# Altium schematic sheet rf transmitter.SchDoc
size A
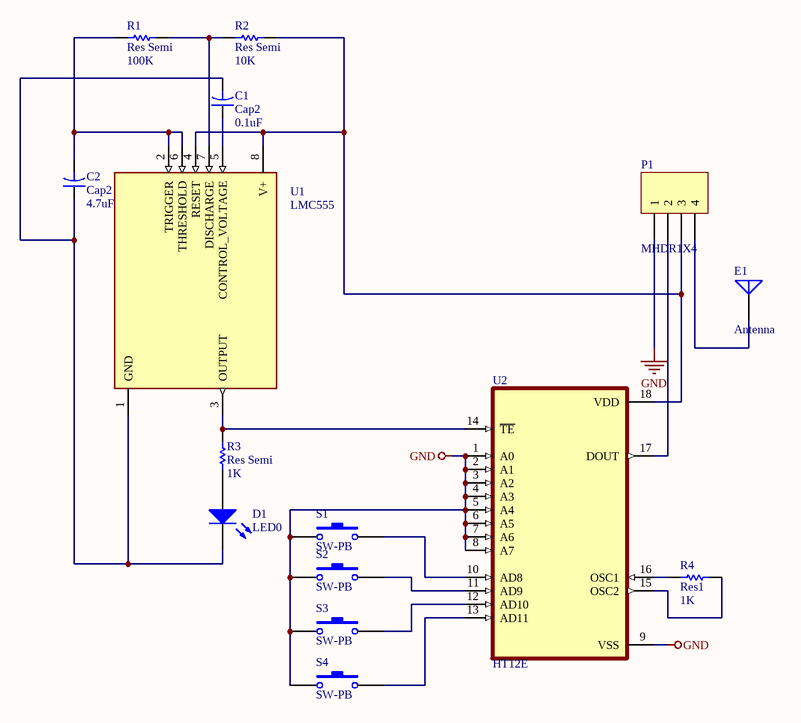
[diagram p0: rf transmitter.SchDoc]

## Parts
C1  Cap2  value 0.1uF  [CAPR5-4X5]
C2  Cap2  value 4.7uF  [CAPR5-4X5]
D1  LED0  [LED-0]
E1  Antenna  [PIN1]
P1  MHDR1X4  [MHDR1X4]
R1  Res Semi  value 100K  [AXIAL-0.5]
R2  Res Semi  value 10K  [AXIAL-0.5]
R3  Res Semi  value 1K  [AXIAL-0.5]
R4  Res1  value 1K  [AXIAL-0.3]
S1  SW-PB  [SPST-2]
S2  SW-PB  [SPST-2]
S3  SW-PB  [SPST-2]
S4  SW-PB  [SPST-2]
U1  LMC555  [LMC555new]
U2  HT12E  [HT12E]

## Nets
GND: P1.1 S1.1 S2.1 S3.1 S4.1 U2.1(A0) U2.2(A1) U2.3(A2) U2.4(A3) U2.5(A4) U2.6(A5) U2.7(A6) U2.8(A7) U2.9(VSS)
NetC1_1: C1.1 U1.5(CONTROL_VOLTAGE)
NetC1_2: C1.2 C2.1 D1.2(K) U1.1(GND)
NetC2_2: C2.2 R1.1 U1.2(TRIGGER) U1.6(THRESHOLD)
NetD1_1: D1.1(A) R3.1
NetE1_1: E1.1(A) P1.4
NetP1_2: P1.2 U2.17(DOUT)
NetP1_3: P1.3 R2.2 U1.4(RESET) U1.8(V+) U2.18(VDD)
NetR1_2: R1.2 R2.1 U1.7(DISCHARGE)
NetR3_2: R3.2 U1.3(OUTPUT) U2.14(~{TE})
NetR4_1: R4.1 U2.16(OSC1)
NetR4_2: R4.2 U2.15(OSC2)
NetS1_2: S1.2 U2.10(AD8)
NetS2_2: S2.2 U2.11(AD9)
NetS3_2: S3.2 U2.12(AD10)
NetS4_2: S4.2 U2.13(AD11)

## Library data of the parts
C1 C2 = Cap2: Capacitor; Published: 23-Sep-2002; PackageReference: CAPR5-4X5; Publisher: Altium Limited; PackageDescription: Capacitor; 2 Leads
D1 = LED0: Typical INFRARED GaAs LED; Published: 8-Jun-2000; LatestRevisionDate: 08-Jul-2005; LatestRevisionNote: Mech Layer 1 removed.; PackageReference: LED-0; Publisher: Altium Limited; PackageDescription: LED; 2 Leads
E1 = Antenna: Generic Antenna; Published: 24-Mar-1999; LatestRevisionDate: 17-Jul-2002; LatestRevisionNote: Re-released for DXP Platform.; PackageReference: PIN1; Publisher: Altium Limited
P1 = MHDR1X4: Header, 4-Pin; LatestRevisionDate: 17-Jul-2002; LatestRevisionNote: Re-released for DXP Platform.; Publisher: Altium Limited
R1-R3 = Res Semi: Semiconductor Resistor; Published: 8-Jun-2000; LatestRevisionDate: 17-Jul-2002; LatestRevisionNote: Re-released for DXP Platform.; PackageReference: AXIAL-0.5; Publisher: Altium Limited; PackageDescription: Axial Device, Thru-Hole; 2 Leads; 0.5 in Pin Spacing
R4 = Res1: Resistor; Published: 8-Jun-2000; LatestRevisionDate: 17-Jul-2002; LatestRevisionNote: Re-released for DXP Platform.; PackageReference: AXIAL-0.3; Publisher: Altium Limited; PackageDescription: Axial Device, Thru-Hole; 2 Leads; 0.3 in Pin Spacing
S1-S4 = SW-PB: Switch; Published: 24-Mar-1999; LatestRevisionDate: 17-Jul-2002; LatestRevisionNote: Re-released for DXP Platform.; PackageReference: SPST-2; Publisher: Altium Limited; PackageDescription: Switch; 2 Leads
U2 = Encoder